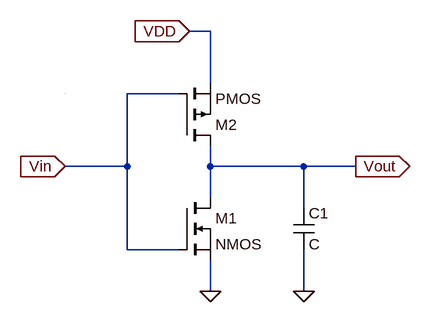
[diagram p0: schematic Draft2.asc]
Draft2.asc, the LTspice schematic file:
Version 4
SHEET 1 880 680
WIRE 224 -96 192 -96
WIRE 224 -16 224 -96
WIRE 176 0 96 0
WIRE 96 112 96 0
WIRE 96 112 0 112
WIRE 224 112 224 80
WIRE 368 112 224 112
WIRE 448 112 368 112
WIRE 224 160 224 112
WIRE 368 176 368 112
WIRE 96 240 96 112
WIRE 176 240 96 240
WIRE 224 304 224 256
WIRE 368 304 368 240
WIRE 0 0 0 0
FLAG 192 -96 VDD
IOPIN 192 -96 In
FLAG 224 304 0
FLAG 368 304 0
FLAG 0 112 Vin
IOPIN 0 112 In
FLAG 448 112 Vout
IOPIN 448 112 Out
SYMBOL nmos 176 160 R0
SYMATTR InstName M1
SYMBOL pmos 176 80 M180
SYMATTR InstName M2
SYMBOL cap 352 176 R0
SYMATTR InstName C1

The netlist it stands for:
* Draft2.asc
M1 Vout Vin 0 0 NMOS
M2 Vout Vin VDD VDD PMOS
C1 Vout 0 C
.model NMOS NMOS
.model PMOS PMOS
.lib standard.mos
.backanno
.end